# EAGLE design JACK_DUAL_M2 (EAGLE 9.6.2)
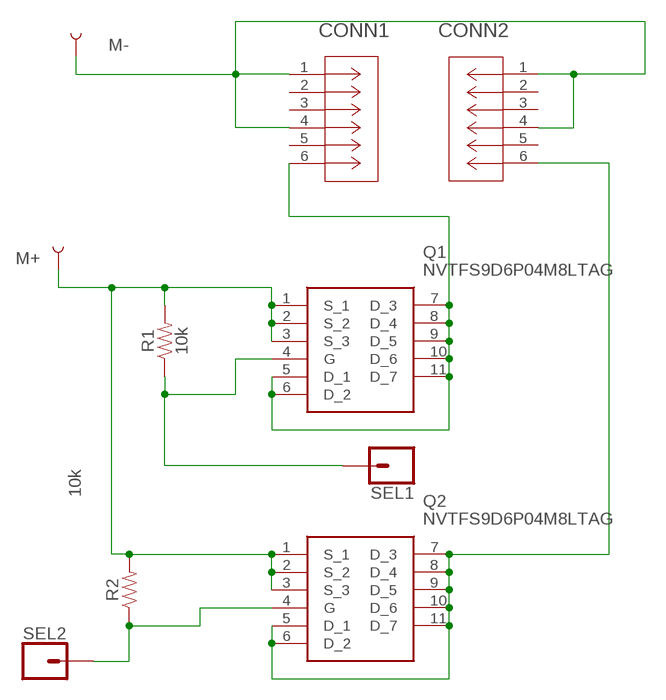
[diagram p0: schematic, sheet 1]

## Parts
CONN1  ACJS-MHDR  [CONN_MHDR_AMP]
CONN2  ACJS-MHDR  [CONN_MHDR_AMP]
M+  TEST-POINT3  [PAD.03X.03]
M-  TEST-POINT3  [PAD.03X.03]
Q1  NVTFS9D6P04M8LTAG  [NVTFS5124PLTWG]
Q2  NVTFS9D6P04M8LTAG  [NVTFS5124PLTWG]
R1  10k  RESISTOR0805  [0805]
R2  10k  RESISTOR0805  [0805]
SEL1  CONN_01  [1X01]
SEL2  CONN_01  [1X01]

## Nets
GND: CONN1.1 CONN1.4 CONN2.1 CONN2.4 M-.P$1
M+: M+.P$1 Q1.1(S_1) Q1.2(S_2) Q1.3(S_3) Q2.1(S_1) Q2.2(S_2) Q2.3(S_3) R1.2 R2.2
N$1: CONN1.6 Q1.5(D_1) Q1.6(D_2) Q1.7(D_3) Q1.8(D_4) Q1.9(D_5) Q1.10(D_6) Q1.11(D_7)
N$2: CONN2.6 Q2.5(D_1) Q2.6(D_2) Q2.7(D_3) Q2.8(D_4) Q2.9(D_5) Q2.10(D_6) Q2.11(D_7)
N$4: Q1.4(G) R1.1 SEL1.1
N$7: Q2.4(G) R2.1 SEL2.1
Unconnected: CONN1.2 CONN1.3 CONN1.5 CONN2.2 CONN2.3 CONN2.5

## Library data of the parts
CONN1 CONN2 = ACJSMHDR_JACK:ACJS-MHDR; BUILT_BY: EMA_Matt; COPYRIGHT: Copyright (C) 2018 Accelerated Designs. All rights reserved; MANUFACTURER_PART_NUMBER: ACJS-MHDR; SOURCELIBRARY: Amphenol_2019-10-30; VENDOR: Amphenol
M+ M- = SparkFun-Connectors:TEST-POINT: SparkFun Test Points Bare copper test points for troubleshooting or In-Circuit-Testing. These are used by our Production team for verifying production board runs using pogo-pins on test beds. SparkFun Products: SparkFun LSM9DS1 Breakout <https://www.sparkfun.com/products/13284> SparkFun PSOC <https://www.sparkfun.com/products/13714> SparkFun Load Cell Amplifier <https://www.sparkfun.com/products/13879>
Q1 Q2 = SamacSys_Parts:NVTFS9D6P04M8LTAG: MOSFET MV8 P INITIAL PROGRAM Source: Datasheet <https://www.onsemi.com/pub/Collateral/NVTFS9D6P04M8L-D.PDF>; DESCRIPTION: MOSFET MV8 P INITIAL PROGRAM; HEIGHT: 0.8mm; MANUFACTURER_NAME: ON Semiconductor; MANUFACTURER_PART_NUMBER: NVTFS9D6P04M8LTAG; MOUSER_PART_NUMBER: 863-NVTFS9D6P04M8LTG; MOUSER_PRICE-STOCK: https://www.mouser.co.uk/ProductDetail/ON-Semiconductor/NVTFS9D6P04M8LTAG/?qs=xZ%2FP%252Ba9zWqYALd8g5rll2Q%3D%3D
R1 R2 = SparkFun-Resistors:RESISTOR: Generic Resistor Package
SEL1 SEL2 = SparkFun-Connectors:CONN_01: Single connection point. Often used as Generic Header-pin footprint for 0.1 inch spaced/style header connections On any of the 0.1 inch spaced packages, you can populate with these: Break Away Headers - Straight <https://www.sparkfun.com/products/116> (PRT-00116) Break Away Male Headers - Right Angle <https://www.sparkfun.com/products/553> (PRT-00553) Female Headers <https://www.sparkfun.com/products/115> (PRT-00115) Break Away Headers - Machine Pin <https://www.sparkfun.com/products/117> (PRT-00117) Break Away Female Headers - Swiss Machine Pin <https://www.sparkfun.com/products/743> (PRT-00743) This device is also useful as a general connection point to wire up your design to another part of your project. Our various solder wires solder well into these plated through hole pads. Hook-Up Wire - Assortment (Stranded, 22 AWG) <https://www.sparkfun.com/products/11375> (PRT-11375) Hook-Up Wire - Assortment (Solid Core, 22 AWG) <https://www.sparkfun.com/products/11367> (PRT-11367) View the entire wire category on our website here <https://www.sparkfun.com/categories/141> Special notes: SMTSO-256-ET is a "flush mount" nut for a 4-40 screw. We mostly use this on specialty testbeds; it is a nice way to connect hardware to your PCB at an adjustable hieght. Also note, the SNAP packages are for using a snappable style connector. We sell a baggie of snaps and they are also used on two LilyPad designs: Snap Assortment - 30 pack (male and female) <https://www.sparkfun.com/products/11347> (DEV-11347) LilyPad Arduino SimpleSnap <https://www.sparkfun.com/products/10941> (DEV-10941) LilyPad SimpleSnap Protoboard <https://www.sparkfun.com/products/10940> (DEV-10940)

## Board
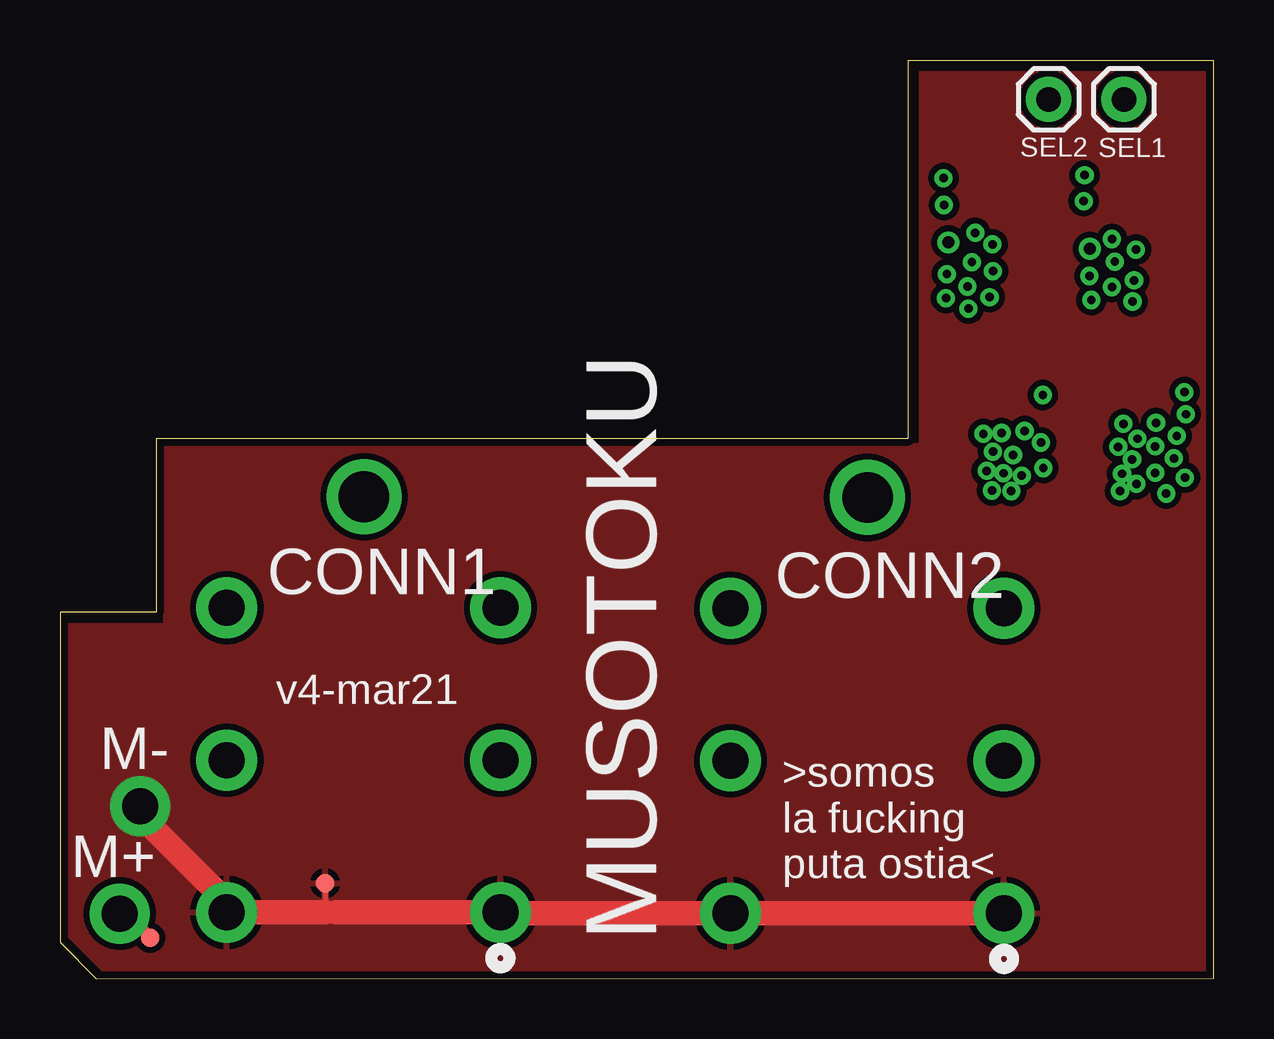
[diagram p1: board, top side]
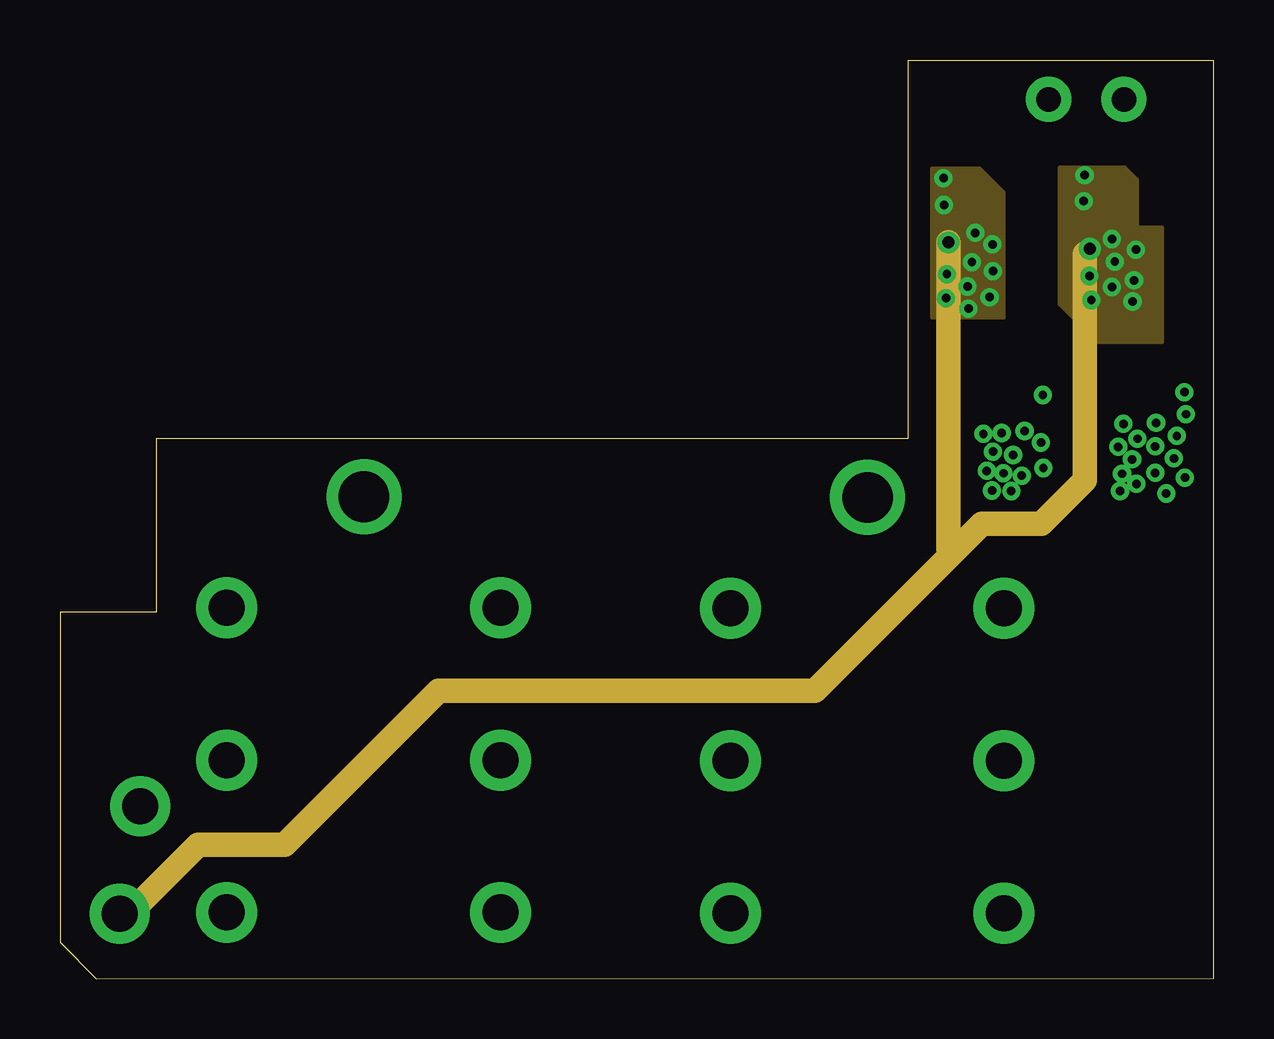
[diagram p2: board, inner layer Route2]
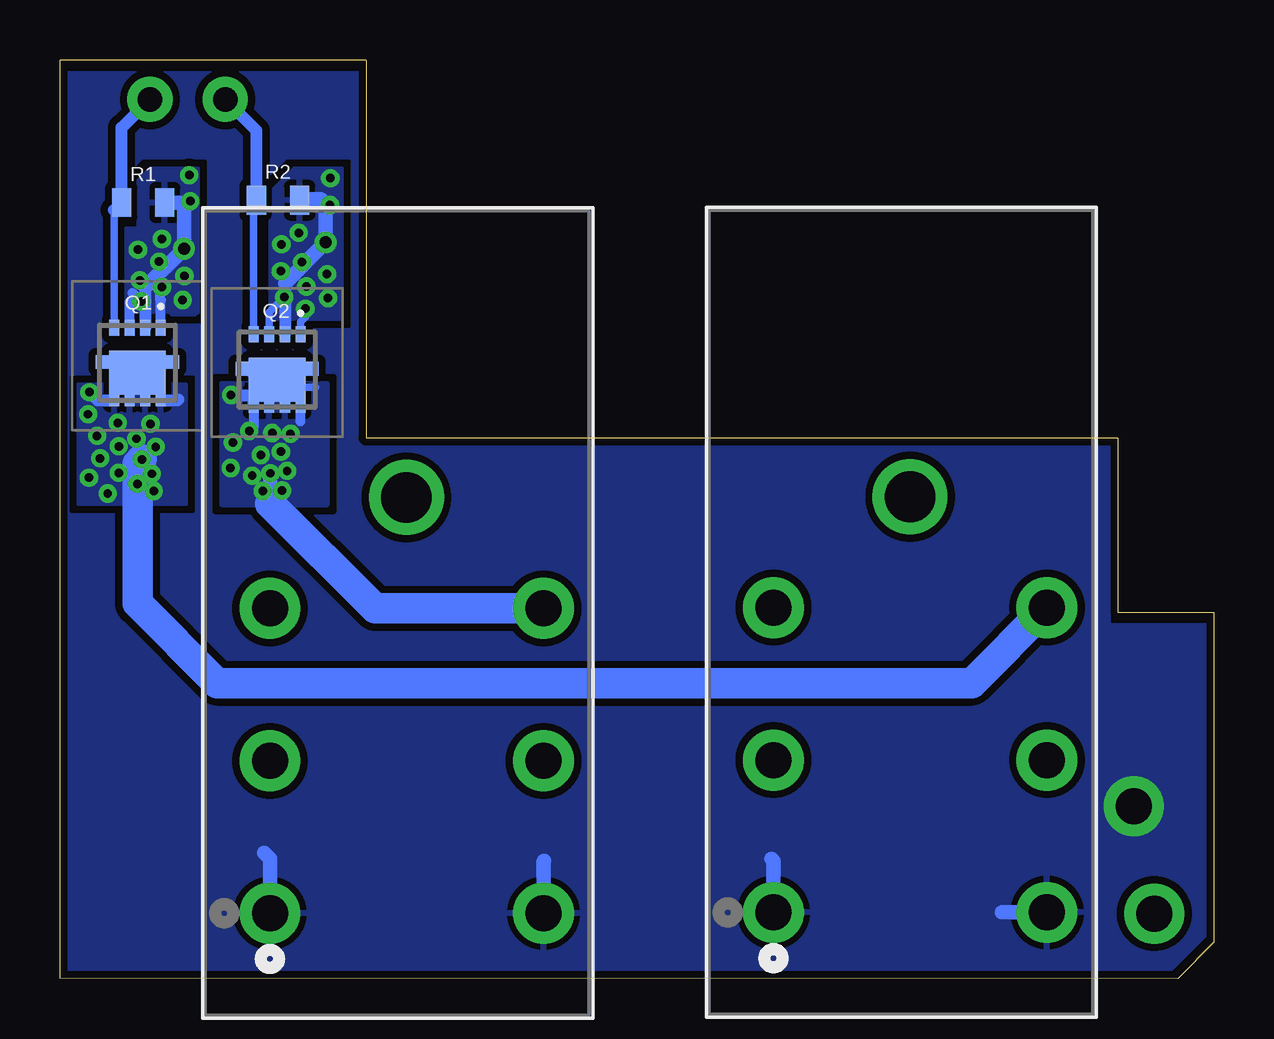
[diagram p3: board, bottom side, seen from below]

Size 48.1 x 38.28 mm. Coordinates in mm from the lower left corner, seen from the top.
Outline: 35.35,38.28 35.35,22.53 4,22.53 4,15.28 0,15.28 0,1.53 1.5,0 48.1,0.01 48.1,38.28 35.35,38.28
Copper layers (1+2*15+16): Top 0.035mm / dielectric 1.5mm / Route2 0.035mm / dielectric 0.15mm / Route15 0.035mm / dielectric 0.2mm / Bottom 0.035mm
Design rules "default *": minimum track width 6mil, minimum drill 0.35mm, track to track 10mil, track to pad 10mil, pad to pad 10mil, via to via 10mil, smd to smd 6mil, copper to edge 12mil, drill to drill 6mil, minimum pad ring 10mil, minimum via ring 8mil, stop-mask expansion 4mil, vias tented up to drill 50mil, thermal gap 10mil

### Footprints (pad centres in the part's own frame; a part is rotated, then mirrored left to right if it is on the bottom)
CONN_MHDR_AMP = drill 1.5 pad 2.54: 1 0,0; 2 -6.35,0; 3 -12.7,0; 4 0,11.405; 5 -6.35,11.405; 6 -12.7,11.405 | drill 2.108 pad 2.616: 7 -17.323,5.69
PAD.03X.03 = smd 0.762 x 0.762: P$1 0,0
NVTFS5124PLTWG = smd 0.42 x 0.66: 1 -0.975,-1.47; 2 -0.325,-1.47; 3 0.325,-1.47; 4 0.975,-1.47 | smd 0.42 x 0.47: 5 0.975,1.565; 6 0.325,1.565; 7 -0.325,1.565; 8 -0.975,1.565 | smd 2.37 x 1.83: 9 0,0.415 | smd 0.545 x 0.57: 10 1.458,-0.035; 11 -1.458,-0.035
0805 = smd 0.8 x 1.2: 1 -0.9,0; 2 0.9,0
1X01 = drill 1.016 pad 1.88: 1 0,0

### Placement (x,y rotation side)
CONN1  18.36,2.76 270 bottom
CONN2  39.35,2.73 270 bottom
M+  3.77,1.71 0 top
M-  11.05,3.98 0 top
Q1  44.87,25.66 180 bottom
Q2  39.05,25.38 180 bottom
R1  44.63,32.34 0 bottom
R2  39.01,32.44 0 bottom
SEL1  44.35,36.64 0 top
SEL2  41.21,36.64 0 top

### Tracks (layer width: path | path; a pad name or v marks a point on that pad's centre or on a via)
GND  (via drill 1.5 pad 2.5)
  Top 0.152: 11.5,2.76 11.05,2.76
  Top 0.254: M-.P$1 11.05,2.76 | 36.35,2.83 36.45,2.73
  Top 1.016: 11.05,2.76 CONN1.4 6.96,3.21 3.35,6.81 v3.35,7.18 | 11.5,2.76 CONN1.1 18.4,2.72 27.94,2.72 CONN2.4 36.45,2.73 CONN2.1
  Bottom 0.61: CONN1.1 18.36,4.91 18.45,5 | CONN2.4 27.95,4.91 27.93,4.92 | CONN1.4 8.81,2.76 8.83,2.78 | CONN2.1 39.35,5 39.59,5.24
  pour Top (isolate 0.254): 0.35,14.78 0.35,1.78 1.85,0.28 47.85,0.28 47.85,37.78 35.85,37.78 35.85,22.28 4.35,22.28 4.35,14.78
  pour Bottom (isolate 0.305, rank 2): -0.15,14.78 4.35,14.78 4.35,22.28 35.35,22.28 35.35,37.78 47.85,37.78 47.85,0.28 1.85,0.28 -0.15,2.28
M+  (via drill 0.35, 0.5, 1.5 pad 2.5)
  Top 0.254: v2.49,2.72 2.95,2.72 3.77,1.89 M+.P$1
  Route2 0.61: 42.71,30.2 v42.93,30.42
  Route2 1.016: v2.49,2.72 2.89,2.72 5.75,5.58 9.37,5.58 15.79,12 31.47,12 37.37,17.9 | 37.37,17.9 38.43,18.96 40.91,18.96 42.71,20.76 42.71,30.2 | v37.03,30.68 37.03,17.9 37.37,17.9
  Bottom 0.305: Q2.1 38.08,27.38 37.87,27.58 v37.87,27.92 | Q2.3 39.38,27.48 39.39,27.5 39.39,27.76 v38.75,28.4
  Bottom 0.406: Q1.1 43.9,28.29 43.93,28.32 43.93,28.74 v43.85,28.82 | Q1.3 45.2,28.2 | 45.07,28.58 v44.71,28.22
  Bottom 0.508: 38.73,28.98 Q2.2 | 44.54,28.8 Q1.2
  Bottom 0.61: R2.2 38.07,32.48 37.21,32.48 37.03,32.3 v37.03,30.68 38.73,28.98 | 44.54,28.8 v42.93,30.42 42.93,32.34 R1.2
  other vias: 36.83,33.36 36.85,32.24 38.15,31.08 38.87,30.6 38.89,29.48 38.01,29.86 37.83,28.84 36.97,29.36 36.93,28.36 42.99,28.28 42.91,29.28 43.85,30.82 44.77,29.1 44.85,30.38 43.97,29.88 42.67,32.4 42.71,33.48
  pour Bottom (isolate 0.254): 36.35,33.78 38.35,33.78 39.35,32.78 39.35,27.48 36.35,27.48
  pour Bottom (isolate 0.254): 42.35,33.78 44.35,33.78 44.85,33.28 44.85,31.28 45.35,31.28 45.35,27.66 42.47,27.66 42.35,27.78
  pour Route2 (isolate 0.254): 36.35,33.78 38.35,33.78 39.35,32.78 39.35,27.54 36.35,27.54
  pour Route2 (isolate 0.254): 41.71,33.78 44.35,33.78 44.85,33.28 44.85,31.28 45.89,31.28 45.89,26.56 43.27,26.56 41.71,28.12
N$1  (via drill 0.35)
  Bottom 0.152: Q1.11 44.42,25.7 Q1.9 | 44.87,24.42 44.87,24.7 Q1.9 | Q1.5 Q1.6 | Q1.10 45.32,25.7 Q1.9
  Bottom 0.254: Q1.7 44.54,24.38 44.87,24.7
  Bottom 0.508: v46.87,24.44 46.52,24.09 Q1.5 | Q1.8 43.21,24.09 43.17,24.14
  Bottom 1.27: CONN1.6 10.09,12.32 41.55,12.32 44.87,15.64 44.87,21.46 v44.69,21.64
  other vias: 44.33,23.12 44.11,22.16 44.27,21.04 44.19,20.32 44.87,20.62 44.91,22.5 45.69,23.16 45.65,22.18 45.65,21.08 46.11,20.22 46.89,20.88 46.43,21.68 46.55,22.62 46.93,23.52
  pour Bottom (isolate 0.254): 42.85,24.78 47.35,24.78 47.35,19.78 42.85,19.78
N$2  (via drill 0.35)
  Bottom 0.152: Q2.10 40.06,24.97 39.38,24.97 | 39.13,24.97 39.25,24.97 | Q2.11 38.6,25.41 Q2.9
  Bottom 0.254: Q2.9 39.13,24.97 | Q2.6 39.38,24.97
  Bottom 0.305: Q2.9 38.73,24.64 37.45,24.64
  Bottom 0.406: 38.08,23.22 Q2.8 | Q2.5 40.02,23.01 v40.21,22.82
  Bottom 0.508: Q2.5 40.02,24.32 v40.97,24.32
  Bottom 0.61: v39.33,21.06 39.33,19.8
  Bottom 1.27: CONN2.6 34.96,15.43 39.33,19.8
  other vias: 38.49,22.7 40.89,22.34 40.09,20.96 40.99,21.28 39.65,20.32 39.73,21.82 38.89,21.96 39.25,22.74 38.63,21.16 38.85,20.34
  pour Bottom (isolate 0.254): 36.97,24.78 41.35,24.78 41.35,19.78 36.97,19.78
N$4
  Bottom 0.305: Q1.4 45.85,32.03
  Bottom 0.508: 45.85,32.03 R1.1 45.53,35.46 SEL1.1
N$7
  Bottom 0.305: Q2.4 40.02,32.33
  Bottom 0.508: 40.02,32.33 R2.1 39.91,35.34 SEL2.1

### Text on the board
tPlace: v4-mar21 | M- | M+ | >somos / la fucking / puta ostia< | MUSOTOKU